# Altium project LED_Ring_80mm.PrjPCB
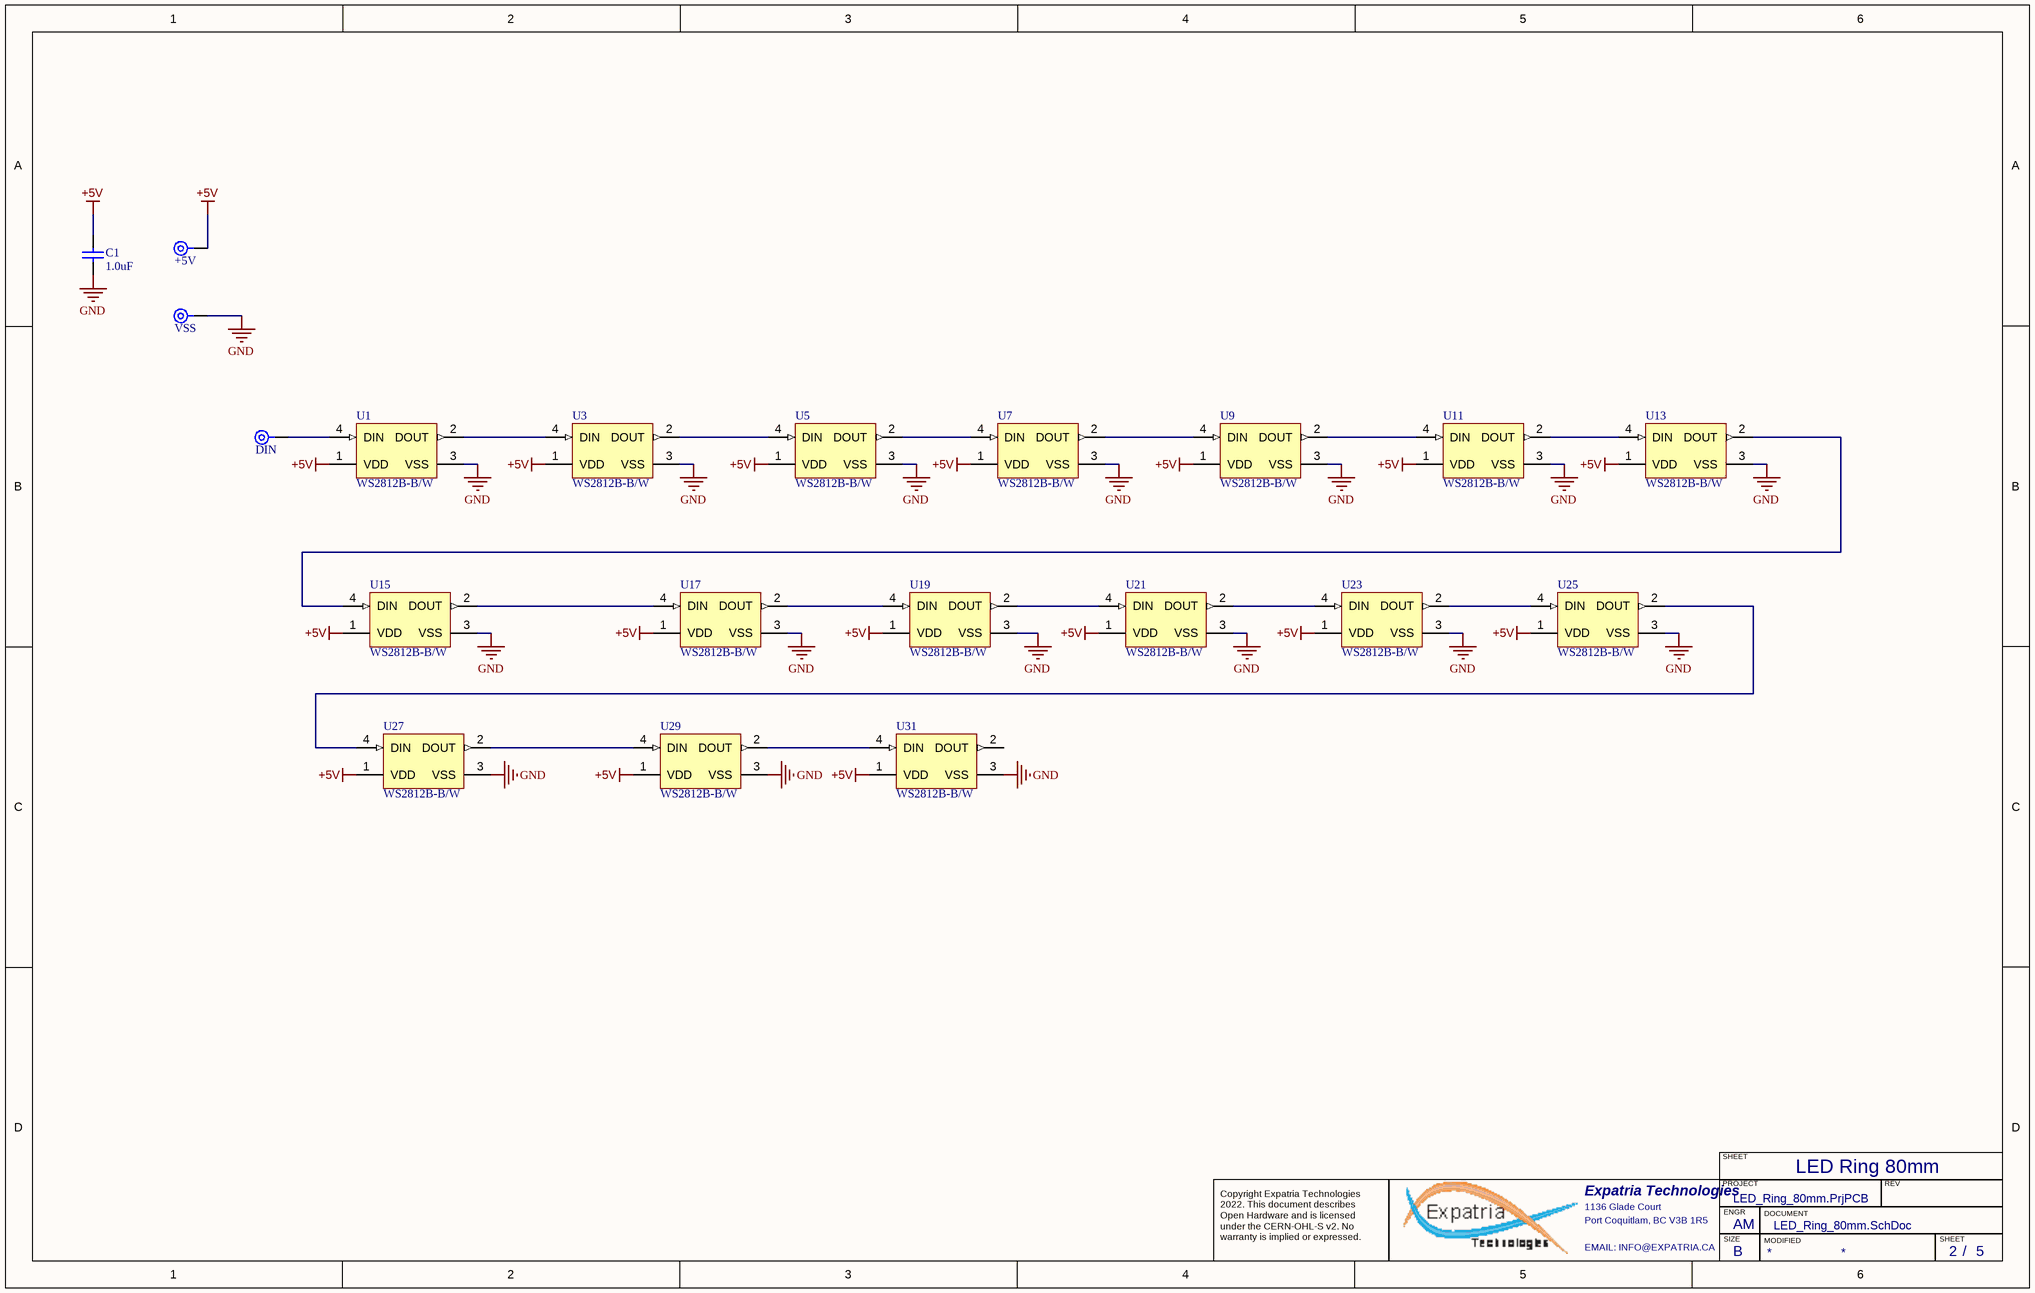
[diagram p0: LED_Ring_80mm.SchDoc]
VarRevNo: A1; Title: FlexiRing_80; PCBREVNO: A1; PCBPARTNO: FlexiRing_80
1 sheet, 20 parts. Net scope: hierarchical (ports join the sheet entries above them; power ports are global).
Board file: LED_Ring_80mm.pcbdoc

## Sheet LED_Ring_80mm.SchDoc: RP2040 CNC
size B; Author: AM; CompanyName: Expatria Technologies; DrawnBy: A.Marles; Engineer: AM; Organization: Expatria Technolgoies; Address1: Schematic; DocumentNumber: 2; Revision: A1; SheetNumber: 2; SheetTotal: 5

### Parts
+5V  Test Loop  [TP/LARGE]  (value not drawn)
C1  1.0uF  [0402_C]
DIN  Test Loop  [TP/LARGE]  (value not drawn)
U1  WS2812B-B/W  [ADA-RGB-1655_V]
U3  WS2812B-B/W  [ADA-RGB-1655_V]
U5  WS2812B-B/W  [ADA-RGB-1655_V]
U7  WS2812B-B/W  [ADA-RGB-1655_V]
U9  WS2812B-B/W  [ADA-RGB-1655_V]
U11  WS2812B-B/W  [ADA-RGB-1655_V]
U13  WS2812B-B/W  [ADA-RGB-1655_V]
U15  WS2812B-B/W  [ADA-RGB-1655_V]
U17  WS2812B-B/W  [ADA-RGB-1655_V]
U19  WS2812B-B/W  [ADA-RGB-1655_V]
U21  WS2812B-B/W  [ADA-RGB-1655_V]
U23  WS2812B-B/W  [ADA-RGB-1655_V]
U25  WS2812B-B/W  [ADA-RGB-1655_V]
U27  WS2812B-B/W  [ADA-RGB-1655_V]
U29  WS2812B-B/W  [ADA-RGB-1655_V]
U31  WS2812B-B/W  [ADA-RGB-1655_V]
VSS  Test Loop  [TP/LARGE]  (value not drawn)

### Nets
+5V: +5V.1 C1.2 U1.1(VDD) U3.1(VDD) U5.1(VDD) U7.1(VDD) U9.1(VDD) U11.1(VDD) U13.1(VDD) U15.1(VDD) U17.1(VDD) U19.1(VDD) U21.1(VDD) U23.1(VDD) U25.1(VDD) U27.1(VDD) U29.1(VDD) U31.1(VDD)
GND: C1.1 U1.3(VSS) U3.3(VSS) U5.3(VSS) U7.3(VSS) U9.3(VSS) U11.3(VSS) U13.3(VSS) U15.3(VSS) U17.3(VSS) U19.3(VSS) U21.3(VSS) U23.3(VSS) U25.3(VSS) U27.3(VSS) U29.3(VSS) U31.3(VSS) VSS.1
NetDIN_1: DIN.1 U1.4(DIN)
NetU1_2: U1.2(DOUT) U3.4(DIN)
NetU3_2: U3.2(DOUT) U5.4(DIN)
NetU5_2: U5.2(DOUT) U7.4(DIN)
NetU7_2: U7.2(DOUT) U9.4(DIN)
NetU9_2: U9.2(DOUT) U11.4(DIN)
NetU11_2: U11.2(DOUT) U13.4(DIN)
NetU13_2: U13.2(DOUT) U15.4(DIN)
NetU15_2: U15.2(DOUT) U17.4(DIN)
NetU17_2: U17.2(DOUT) U19.4(DIN)
NetU19_2: U19.2(DOUT) U21.4(DIN)
NetU21_2: U21.2(DOUT) U23.4(DIN)
NetU23_2: U23.2(DOUT) U25.4(DIN)
NetU25_2: U25.2(DOUT) U27.4(DIN)
NetU27_2: U27.2(DOUT) U29.4(DIN)
NetU29_2: U29.2(DOUT) U31.4(DIN)

Not connected (* = marked no-connect by the designer): U31 2(DOUT)

### Notes on the sheet
- LED Ring 80mm
- SHEET
- Expatria Technologies
- 1136 Glade Court
- Port Coquitlam, BC V3B 1R5
- PROJECT
- SIZE
- ENGR
- MODIFIED
- DOCUMENT
- REV
- Copyright Expatria Technologies 2022. This document describes Open Hardware and is licensed under the CERN-OHL-S v2. No warranty is implied or expressed.
- EMAIL: INFO@EXPATRIA.CA
- B
- /

### Library data of the parts
+5V DIN VSS = TL_5017: PC TEST POINT MINIATURE; Manufacturer 1: Keystone Electronics; Manufacturer Part Number 1: 5017; Number of Ports: 1; Supplier 1: Digi-Key; Supplier Part Number 1: 36-5017CT-ND; Stock 1: 203311; Pricing 1: 1 = 0.47000, 10 = 0.44100, 25 = 0.37800, 50 = 0.32140, 100 = 0.30880, 250 = 0.27732, 500 = 0.26472, 1000 = 0.22061, 2500 = 0.20170 (USD); RoHS: Yes; Mount: Surface Mount; Color: White; Contact Plating: Tin; Contact Material: Bronze; Material: Bronze; Package Quantity: 5000; Packaging: Tape and Reel; Termination: Solder; Orientation: Straight; Length: 2.66mm; Depth: 1.01mm; REACH SVHC: No SVHC; Lead Free: Lead Free; ComponentLink1URL: https://datasheet.ciiva.com/18456/5017-18456885.pdf?src-supplier=Digi-Key; ComponentLink1Description: https://datasheet.ciiva.com/18456/5017-18456885.pdf?src-supplier=Digi-Key; ComponentLink2URL: https://datasheet.ciiva.com/18456/5017-18456886.pdf?src-supplier=Digi-Key; ComponentLink2Description: https://datasheet.ciiva.com/18456/5017-18456886.pdf?src-supplier=Digi-Key; ComponentLink3URL: https://datasheet.ciiva.com/18456/5017-18456887.pdf?src-supplier=Digi-Key; ComponentLink3Description: https://datasheet.ciiva.com/18456/5017-18456887.pdf?src-supplier=Digi-Key; Value: Test Loop
C1 = 0402 1.0uF (105) 10% 25V: Chip capacitor; Manufacturer: Samsung Electro-Mechanics; PartNumber: CL05A105KA5NQNC; Capacitance: 1uF; Tolerance: 10%; Voltage: 25V; ComponentLink1Description: Supplier link; ComponentLink1URL: http://www.szlcsc.com/product/details_53938.html; Package: 0402; Supplier: LC; SuppliersPartNumber: C52923
U1 U3 U5 U7 U9 U11 U13 U15 U17 U19 U21 U23 U25 U27 U29 U31 = CMP-2000-05026-1: Intelligent Control LED Integrated Light Source, 3.5 to 5.3 V, -25 to 80 degC, 4-Pin SMD, RoHS, Tape and Reel; Manufacturer: Worldsemi; Package Description: 4-Pin Surface Mount Device, Body 5 x 5 mm; SuppliersPartNumber: C2874885; Part_Number: WS2812B-B/W

## Assembly variants
FULL_PLACE: not fitted C54 C55 R17 R18 R63 R64 Y3